# Altium schematic sheet schema_moteur.SchDoc
size A4
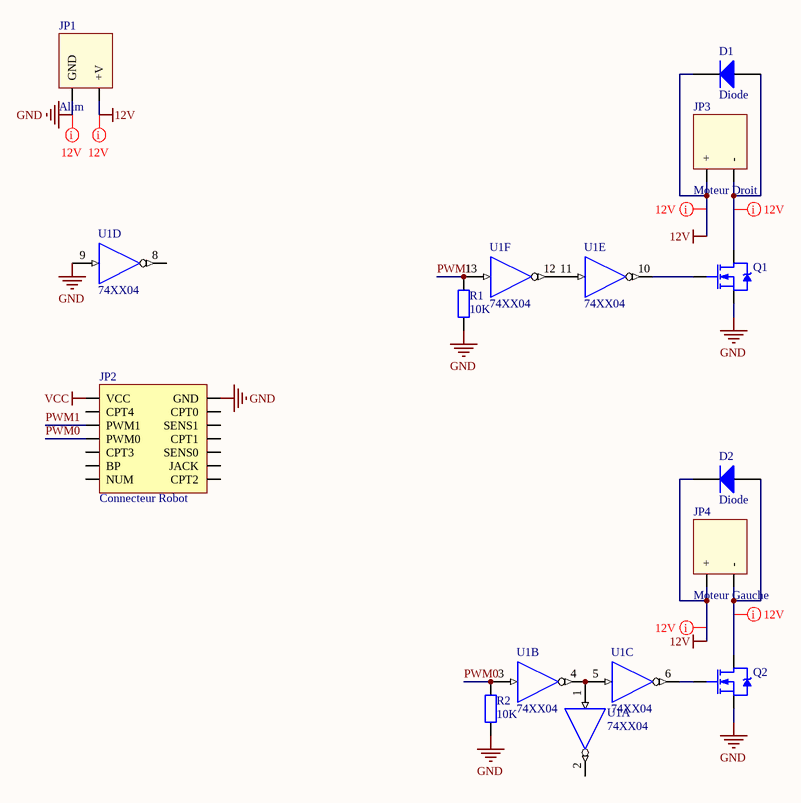
[diagram p0: schema_moteur.SchDoc]

## Parts
D1  Diode  [DO-15]
D2  Diode  [DO-15]
JP1  Alim  [Miniconnect 2pts]
JP2  Connecteur Robot  [HE10 2x7]
JP3  Moteur Droit  [Miniconnect 2pts]
JP4  Moteur Gauche  [Miniconnect 2pts]
Q1  IRL510  [TO220_FLAT]  (value not drawn)
Q2  IRL510  [TO220_FLAT]  (value not drawn)
R1  10K  [Axial_5]
R2  10K  [Axial_5]
U1  74XX04  [SOIC_14]  (parts A,B,C,D,E,F of 6)

## Nets
12V: D1.1(K) D2.1(K) JP1.2(+V) JP3.2(+) JP4.2(+)
GND: JP1.1(GND) JP2.2(GND) Q1.3(S) Q2.3(S) R1.1 R2.1 U1.7(GND) U1.9(A)
VCC: JP2.1(VCC) U1.14(VCC)
PWM0: JP2.7(PWM0) R2.2 U1.3(A)
PWM1: JP2.5(PWM1) R1.2 U1.13(A)
NetD1_2: D1.2(A) JP3.1(-) Q1.2(D)
NetD2_2: D2.2(A) JP4.1(-) Q2.2(D)
NetQ1_1: Q1.1(G) U1.10(Y)
NetQ2_1: Q2.1(G) U1.6(Y)
NetU1_1: U1.1(A) U1.4(Y) U1.5(A)
NetU1_11: U1.11(A) U1.12(Y)

Not connected (* = marked no-connect by the designer): JP2 3(CPT4) 4(CPT0) 6(SENS1) 8(CPT1) 9(CPT3) 10(SENS0) 11(BP) 12(JACK) 13(NUM) 14(CPT2); U1 2(Y) 8(Y)

## Layout directives
net class Power: 12V, GND, NetD1_2, NetD2_2

## Library data of the parts
D1 D2 = Diode: Diode Générique; Revision 1: 11-Jul-2000: SIM Model Added.; Revision 2: 17-Jul-2002: Re-released for DXP Platform.; Published: 8-Jun-2000; Datasheet: Latest Revision: 1997; Publisher: Altium Limited; Supplier 1: Farnell; Supplier Part Number 1: 1561708
JP1 = Connecteur Alimentation: Connecteur d'alimentation; Manufacturer: IMO PRECISION CONTROLS; Manufacturer Part Number: 21.95MH/2; RoHS: YES; ComponentLink1URL: http://www.farnell.com/cad/80517.pdf; ComponentLink1Description: http://www.farnell.com/cad/80517.pdf; Supplier 1: Farnell; Stock 1: 1666; Pricing 1: 1=0,36, 25=0,35, 100=0,31, 250=0,29, 500=0,27 (EUR); Supplier Part Number 1: 9633197
JP2 = HE10 Robot: Connecteurr pour robot S1
JP3 JP4 = Miniconnect: Connecteur de puissance 2 pts; Manufacturer: PHOENIX CONTACT; Manufacturer Part Number: 1757242; Nombre de Positions: 2; Tension nominale: 250; Courant: 12; Pas: 5.08; Orientation bloc: Traversant angle droit; Genre: Embase; SVHC: No SVHC (15-Jun-2015); Catégories d'approbation: UL 94V-0; Diamètre de perçage du circuit imprimé: 1.4; Gamme de produit: Série MSTBA; Inflammabilité: UL94V-0; Méthode de terminaison: A souder; Tension, fonctionnement: 320; Terminaison du contact: Traversant à angle droit; Type de terminaison de contact: Traversant<!--FANDB--><div class="features-and-benefits-container"></div>; Supplier 1: Farnell; RoHS: YES; Stock 1: 3812; Pricing 1: 1=0,54, 25=0,475, 100=0,451, 250=0,427, 500=0,376, 1000=0,353, 2000=0,346, 5000=0,339 (EUR); ComponentLink1URL: http://www.farnell.com/datasheets/100955.pdf; ComponentLink1Description: http://www.farnell.com/datasheets/100955.pdf; Supplier Part Number 1: 3705171; Nombre de contacts: 2; Nombre de rangées: 2
Q1 Q2 = IRL510: HEXFET N-Channel Power MOSFET; Manufacturer: VISHAY FORMERLY I.R.; Manufacturer Part Number: IRL510PBF; Polarité transistor: N Channel; Courant, Id cont.: 5.6; Tension Vds max..: 100; Résistance Rds(on): 540; Tension, mesure Rds: 5; Tension, Vgs th typ.: 2; Dissipation de puissance Pd: 43; Type de boîtier de transistor: TO-220; Nombre de broches: 3; Tension, Vgs max..: 10; Type de terminaison: Traversant; Revision 1: 10-Jul-2000: SIM Model Added.; Revision 2: 17-Jul-2002: Re-released for DXP Platform.; Package Information: Latest Revision: Feb-1997; Note: Pin 2 is electrically connected to pin 4.; Température de fonctionnement: -55°C à +175; Courant, Idm impul.: 18; Nombre de transistors: 1; Pas: 2.54; Température, courant: 25; Supplier 1: Farnell; Supplier Part Number 1: 9102779; RoHS: YES; Pricing 1: 1=1,27, 25=0,8, 100=0,62, 250=0,55, 1000=0,49 (EUR); Courant, Id max..: 5.6; Dissipation de puissance: 43; Tension, Vds typ.: 100; Tension, Vgs, mesure de Rds on: 5; Type de boîtier: TO-220; ComponentLink1URL: http://www.irf.com/product-info/datasheets/data/irl510pbf.pdf; ComponentLink1Description: http://www.irf.com/product-info/datasheets/data/irl510pbf.pdf; Published: 8-Jun-2000; Datasheet: Latest Revision: PD-9.560C; Package Reference: TO-220AB; Publisher: Altium Limited; Stock 1: 1568; Puissance Pd: 43; Température, puissance: 25; Tension, Vgs th max..: 2
R1 R2 = Res: Resistance; Published: 8-Jun-2000; Revision: July-2002: Re-released for DXP Platform.; Publisher: Altium Limited; Supplier 2: Farnell; Supplier Part Number 2: 2057836; Value: 10K
U1 = 74XX04: Hex Inverter; Type de logique: INVERSEUR; Nombre d'entrées: 1; Nombre de broches: 14; SVHC: No SVHC (19-Dec-2011); Gamme de température, circuit intégré: Commercial; Numéro de base de la fonction logique: 7404; Racine de la référence: 74; Nombre de portes: 6; Published: 8-Jun-2000; Revision: 17-Jul-2002: Re-released for DXP Platform.; Publisher: Altium Limited; ComponentLink1Description: datasheet famille HC; ComponentLink1URL: http://www.ti.com/lit/ds/symlink/sn74hc04.pdf; ComponentLink2URL: http://www.ti.com/lit/ds/symlink/sn74hct04.pdf; ComponentLink2Description: Datasheet famille HCT; ComponentLink3Description: Datasheet famille LS; ComponentLink3URL: http://www.ti.com/lit/ds/symlink/sn74ls04.pdf; Pricing 1: 1=0,8 (EUR); Fonction logique: Hex Inverter; ComponentLink4URL: http://www.farnell.com/datasheets/313136.pdf; ComponentLink4Description: TI : 7404 / 74S04 / 74LS04; Supplier 1: Farnell; Supplier Part Number 1: 1753052; Stock 1: 1521; ComponentLink5URL: http://www.farnell.com/datasheets/88929.pdf; ComponentLink5Description: Fairchild : 74HC04; ComponentLink6URL: http://www.farnell.com/datasheets/410597.pdf; ComponentLink6Description: REACH; ComponentLink7URL: http://www.nxp.com/acrobat/datasheets/74HC_HCT04_3.pdf; ComponentLink7Description: NXP : 74HC04 / 74HCT04; ComponentLink8URL: http://www.farnell.com/cad/311261.pdf; ComponentLink8Description: NXP : HCMOS family characteristics; ComponentLink9URL: http://www.farnell.com/datasheets/66629.pdf; ComponentLink9Description: NXP : Brief Datasheet